# Altium schematic sheet FMC-USB-PHY-BOARD_r0.2.SchDoc: FMC-USB-PHY-BOARD-R02
size 594 x 420 mm; Author: T. Ludemann; Revision: R02; SheetNumber: 1; SheetTotal: 1; DocSize: DINA2
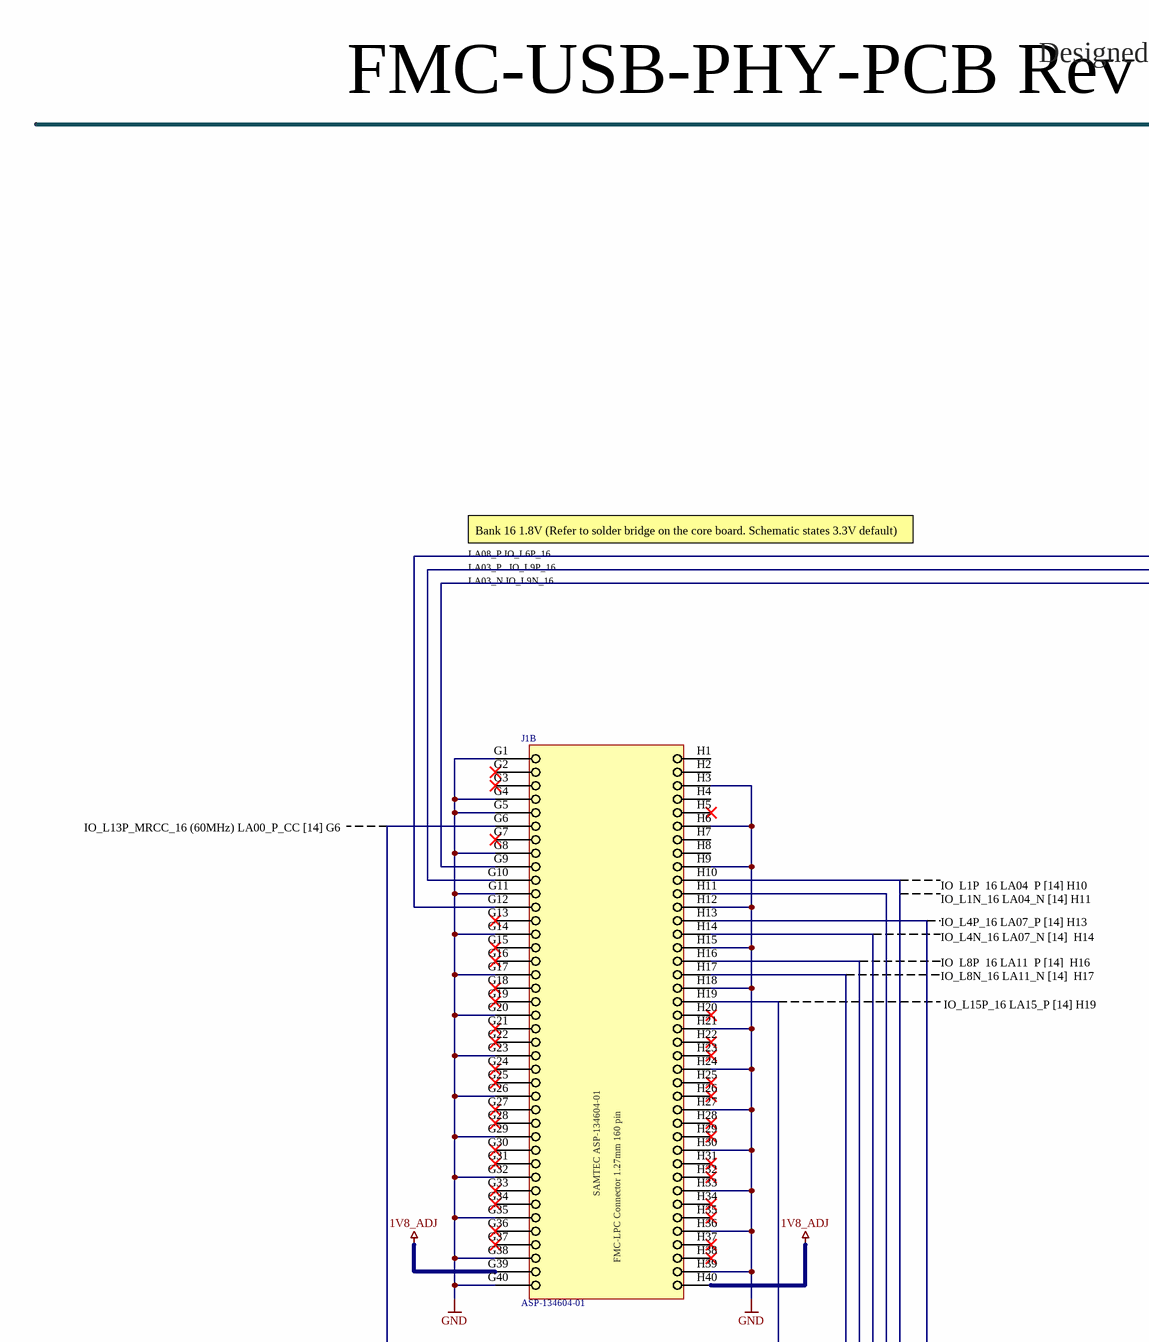
[diagram p0: FMC-USB-PHY-BOARD_r0.2.SchDoc, top left]
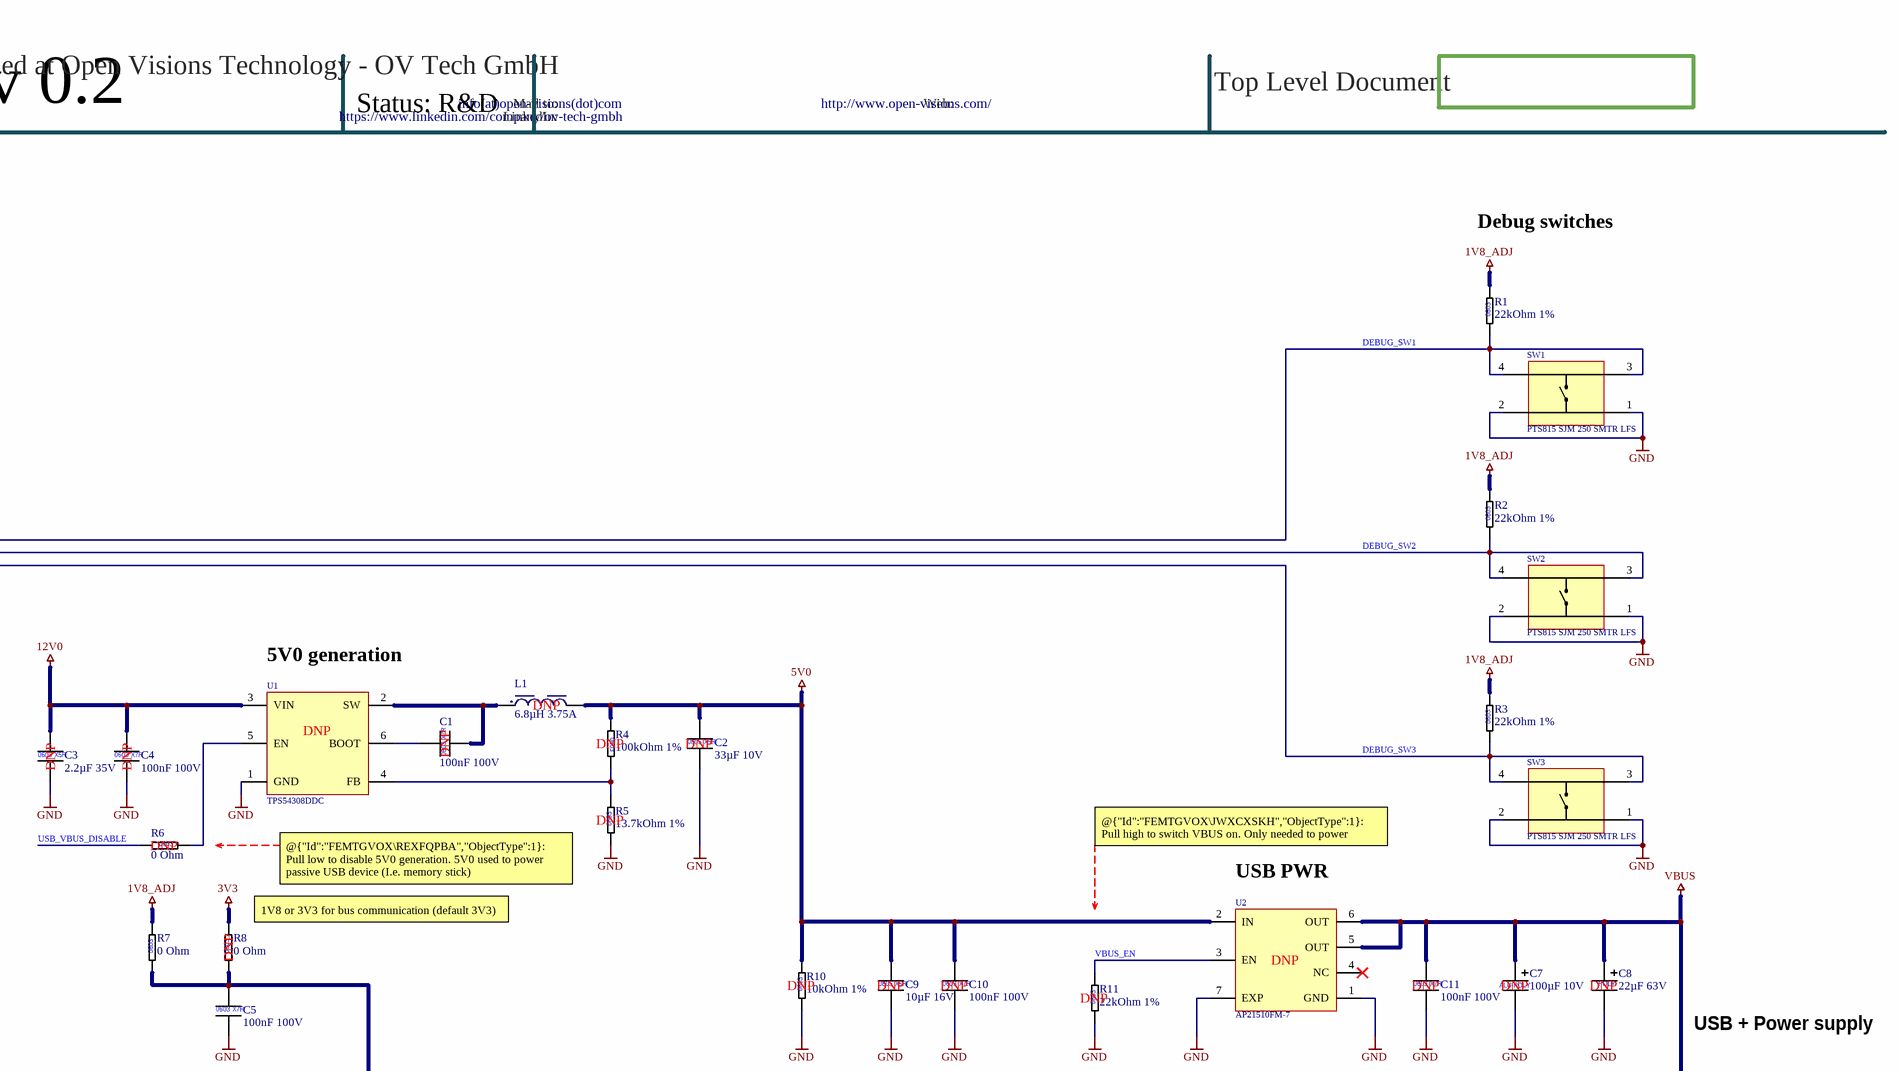
[diagram p1: FMC-USB-PHY-BOARD_r0.2.SchDoc, top right]
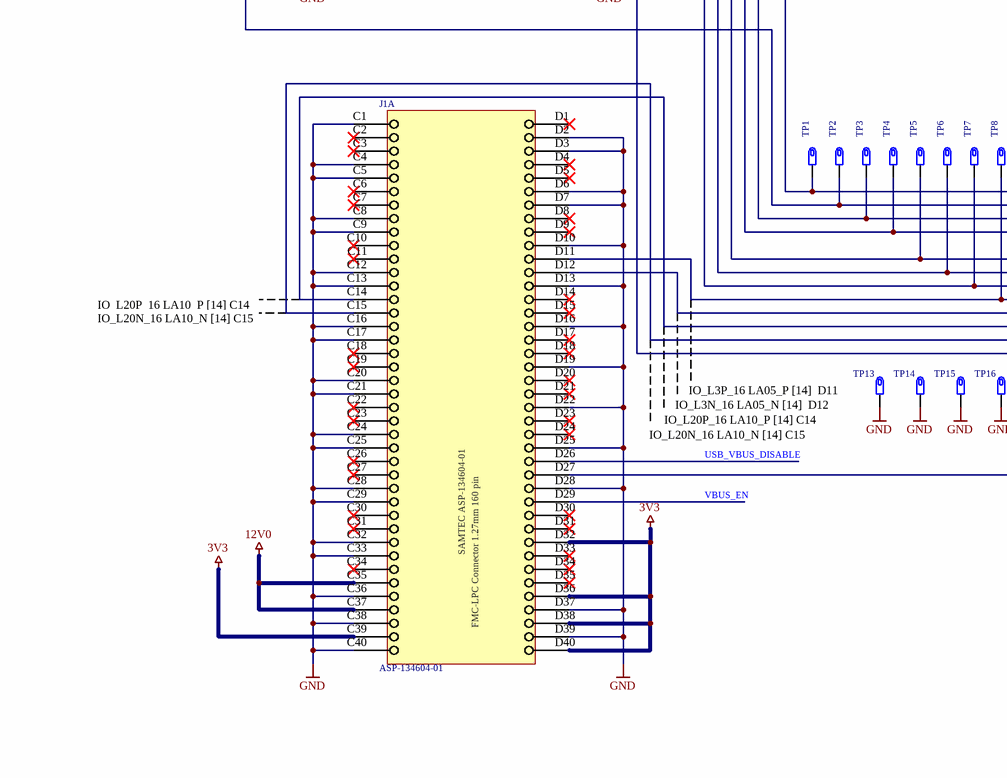
[diagram p2: FMC-USB-PHY-BOARD_r0.2.SchDoc, bottom left]
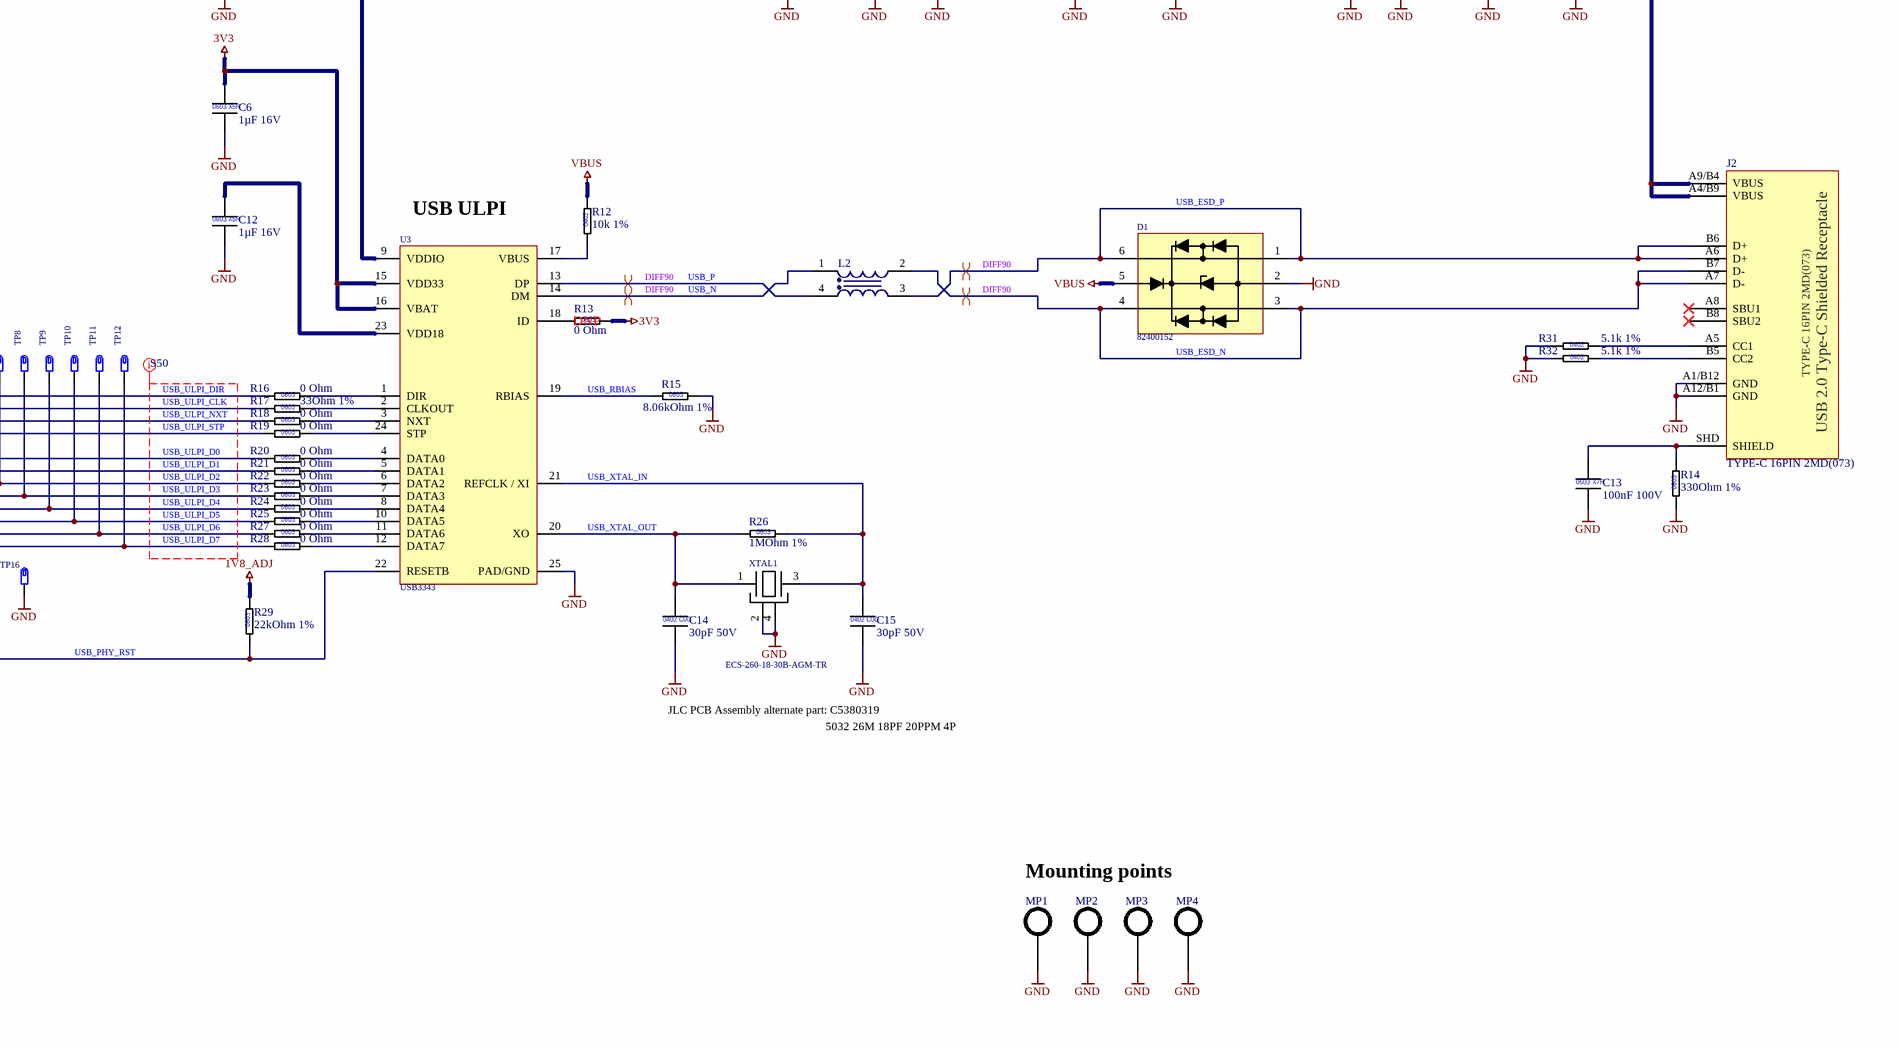
[diagram p3: FMC-USB-PHY-BOARD_r0.2.SchDoc, bottom right]

## Parts
?  (no value)  (graphical)
C1  100nF 100V  [CAPC1608X10L]  (no BOM)
C2  33µF 10V  [CAPC2012X14L]  (no BOM)
C3  2.2µF 35V  [CAPC1608X10L]  (no BOM)
C4  100nF 100V  [CAPC1608X10L]  (no BOM)
C5  100nF 100V  [CAPC1608X10L]
C6  1µF 16V  [CAPC1608X10L]
C7  100µF 10V  [CAP_Radial_5x8mm]  (no BOM)
C8  22µF 63V  [CAPAE9083X70N]  (no BOM)
C9  10µF 16V  [CAPC2012X14L]  (no BOM)
C10  100nF 100V  [CAPC1608X10L]  (no BOM)
C11  100nF 100V  [CAPC1608X10L]  (no BOM)
C12  1µF 16V  [CAPC1608X10L]
C13  100nF 100V  [CAPC1608X10L]
C14  30pF 50V  [CAPC1005X06L]
C15  30pF 50V  [CAPC1005X06L]
D1  82400152  [WE-TVS_SOT563]
J1  ASP-134604-01  [BOARD-TO-BOARD CON SAMTEC_ASP-134604-01]  (parts A,B of 2)
J2  TYPE-C 16PIN 2MD(073)  [USB Type C - TYPE-C 16PIN 2MD(073)]
L1  6.8µH 3.75A  [WE-MAPI_4030]  (no BOM)
L2  90Ohm 100mA  [WE-CNSW_0603]  (value not drawn)
MP1  MP_MOUNT_3MM_Plated  [MP_3MM_Plated]  (value not drawn)  (no BOM)
MP2  MP_MOUNT_3MM_Plated  [MP_3MM_Plated]  (value not drawn)  (no BOM)
MP3  MP_MOUNT_3MM_Plated  [MP_3MM_Plated]  (value not drawn)  (no BOM)
MP4  MP_MOUNT_3MM_Plated  [MP_3MM_Plated]  (value not drawn)  (no BOM)
R1  22kOhm 1%  [RESC1608X04L]
R2  22kOhm 1%  [RESC1608X04L]
R3  22kOhm 1%  [RESC1608X04L]
R4  100kOhm 1%  [RESC1608X04L]  (no BOM)
R5  13.7kOhm 1%  [RESC1608X04L]  (no BOM)
R6  0 Ohm  [RESC1608X04L]  (no BOM)
R7  0 Ohm  [RESC1608X04L]
R8  0 Ohm  [RESC1608X04L]  (no BOM)
R10  10kOhm 1%  [RESC1608X04L]  (no BOM)
R11  22kOhm 1%  [RESC1608X04L]  (no BOM)
R12  10k 1%  [RESC1005X04L]
R13  0 Ohm  [RESC1608X04L]  (no BOM)
R14  330Ohm 1%  [RESC1608X04L]
R15  8.06kOhm 1%  [RESC1608X04L]
R16  0 Ohm  [RESC1608X04L]
R17  33Ohm 1%  [RESC1608X04L]
R18  0 Ohm  [RESC1608X04L]
R19  0 Ohm  [RESC1608X04L]
R20  0 Ohm  [RESC1608X04L]
R21  0 Ohm  [RESC1608X04L]
R22  0 Ohm  [RESC1608X04L]
R23  0 Ohm  [RESC1608X04L]
R24  0 Ohm  [RESC1608X04L]
R25  0 Ohm  [RESC1608X04L]
R26  1MOhm 1%  [RESC1608X04L]
R27  0 Ohm  [RESC1608X04L]
R28  0 Ohm  [RESC1608X04L]
R29  22kOhm 1%  [RESC1608X04L]
R31  5.1k 1%  [RESC1005X04L]
R32  5.1k 1%  [RESC1005X04L]
SW1  PTS815 SJM 250 SMTR LFS  [SW_TACT_PTS815 SJM 250 SMTR LFS]
SW2  PTS815 SJM 250 SMTR LFS  [SW_TACT_PTS815 SJM 250 SMTR LFS]
SW3  PTS815 SJM 250 SMTR LFS  [SW_TACT_PTS815 SJM 250 SMTR LFS]
TP1  4952  [TP_Keystone_4952]  (value not drawn)
TP2  4952  [TP_Keystone_4952]  (value not drawn)
TP3  4952  [TP_Keystone_4952]  (value not drawn)
TP4  4952  [TP_Keystone_4952]  (value not drawn)
TP5  4952  [TP_Keystone_4952]  (value not drawn)
TP6  4952  [TP_Keystone_4952]  (value not drawn)
TP7  4952  [TP_Keystone_4952]  (value not drawn)
TP8  4952  [TP_Keystone_4952]  (value not drawn)
TP9  4952  [TP_Keystone_4952]  (value not drawn)
TP10  4952  [TP_Keystone_4952]  (value not drawn)
TP11  4952  [TP_Keystone_4952]  (value not drawn)
TP12  4952  [TP_Keystone_4952]  (value not drawn)
TP13  4952  [TP_Keystone_4952]  (value not drawn)
TP14  4952  [TP_Keystone_4952]  (value not drawn)
TP15  4952  [TP_Keystone_4952]  (value not drawn)
TP16  4952  [TP_Keystone_4952]  (value not drawn)
U1  TPS54308DDC  [SOT95P280X110-6N]  (no BOM)
U2  AP21510FM-7  [QFN50P201X181X60_HS-7N]  (no BOM)
U3  USB3343  [QFN50P400X400X100_HS-25M]
XTAL1  ECS-260-18-30B-AGM-TR  [XTAL_ECX-53B_5X3.2X0.85]

## Nets
1V8_ADJ: J1.G39 J1.H40 R1.2 R2.2 R3.2 R7.2 R29.2
3V3: C6.1 J1.C39 J1.D32 J1.D36 J1.D38 J1.D40 R8.2 R13.2 U3.15(VDD33) U3.16(VBAT)
5V0: C2.1 C9.1 C10.1 L1.1 R4.1 R10.2 U2.2(IN)
12V0: C3.1 C4.1 J1.C35 J1.C37 U1.3(VIN)
GND: C2.2 C3.2 C4.2 C5.2 C6.2 C7.2 C8.2 C9.2 C10.2 C11.2 C12.2 C13.2 C14.2 C15.2 D1.2(GND) J1.C1 J1.C4 J1.C5 J1.C8 J1.C9 J1.C12 J1.C13 J1.C16 J1.C17 J1.C20 J1.C21 J1.C24 J1.C25 J1.C28 J1.C29 J1.C32 J1.C33 J1.C36 J1.C38 J1.C40 J1.D2 J1.D3 J1.D6 J1.D7 J1.D10 J1.D13 J1.D16 J1.D19 J1.D22 J1.D25 J1.D28 J1.D37 J1.D39 J1.G1 J1.G4 J1.G5 J1.G8 J1.G11 J1.G14 J1.G17 J1.G20 J1.G23 J1.G26 J1.G29 J1.G32 J1.G35 J1.G38 J1.G40 J1.H3 J1.H6 J1.H9 J1.H12 J1.H15 J1.H18 J1.H21 J1.H24 J1.H27 J1.H30 J1.H33 J1.H36 J1.H39 J2.A1/B12(GND) J2.A12/B1(GND) MP1.1 MP2.1 MP3.1 MP4.1 R5.1 R10.1 R11.1 R14.1 R15.2 R31.1 R32.1 SW1.1 SW1.2 SW2.1 SW2.2 SW3.1 SW3.2 TP13.TP TP14.TP TP15.TP TP16.TP U1.1(GND) U2.1(GND) U2.7(EXP) U3.25(PAD/GND) XTAL1.2 XTAL1.4
VBUS: C7.1 C8.1 C11.1 D1.5(VDD) J2.A4/B9(VBUS) J2.A9/B4(VBUS) R12.2 U2.5(OUT) U2.6(OUT)
DEBUG_SW1: J1.G12 R1.1 SW1.3 SW1.4
DEBUG_SW2: J1.G10 R2.1 SW2.3 SW2.4
DEBUG_SW3: J1.G9 R3.1 SW3.3 SW3.4
USB_ESD_N: D1.3(I/O_2) D1.4(I/O_2) J2.A7(D-) J2.B7(D-) L2.2
USB_ESD_P: D1.1(I/O_1) D1.6(I/O_1) J2.A6(D+) J2.B6(D+) L2.3
USB_N: L2.1 U3.14(DM)
USB_P: L2.4 U3.13(DP)
USB_PHY_RST: J1.D27 R29.1 U3.22(RESETB)
USB_RBIAS: R15.1 U3.19(RBIAS)
USB_ULPI_CLK: J1.G6 R17.1 TP2.TP
USB_ULPI_D0: J1.H14 R20.1 TP5.TP
USB_ULPI_D1: J1.H16 R21.1 TP6.TP
USB_ULPI_D2: J1.H17 R22.1 TP7.TP
USB_ULPI_D3: J1.D11 R23.1 TP8.TP
USB_ULPI_D4: J1.D12 R24.1 TP9.TP
USB_ULPI_D5: J1.C14 R25.1 TP10.TP
USB_ULPI_D6: J1.C15 R27.1 TP11.TP
USB_ULPI_D7: J1.H19 R28.1 TP12.TP
USB_ULPI_DIR: J1.H13 R16.1 TP1.TP
USB_ULPI_NXT: J1.H10 R18.1 TP3.TP
USB_ULPI_STP: J1.H11 R19.1 TP4.TP
USB_VBUS_DISABLE: J1.D26 R6.1
USB_XTAL_IN: C15.1 R26.2 U3.21(REFCLK_/_XI) XTAL1.3
USB_XTAL_OUT: C14.1 R26.1 U3.20(XO) XTAL1.1
VBUS_EN: J1.D29 R11.2 U2.3(EN)
NetC1_1: C1.1 U1.6(BOOT)
NetC1_2: C1.2 L1.2 U1.2(SW)
NetC5_1: C5.1 R7.1 R8.1 U3.9(VDDIO)
NetC12_1: C12.1 U3.23(VDD18)
NetC13_1: C13.1 J2.SHD(SHIELD) R14.2
NetJ2_A5: J2.A5(CC1) R31.2
NetJ2_B5: J2.B5(CC2) R32.2
NetR4_2: R4.2 R5.2 U1.4(FB)
NetR6_2: R6.2 U1.5(EN)
NetR12_1: R12.1 U3.17(VBUS)
NetR13_1: R13.1 U3.18(ID)
NetR16_2: R16.2 U3.1(DIR)
NetR17_2: R17.2 U3.2(CLKOUT)
NetR18_2: R18.2 U3.3(NXT)
NetR19_2: R19.2 U3.24(STP)
NetR20_2: R20.2 U3.4(DATA0)
NetR21_2: R21.2 U3.5(DATA1)
NetR22_2: R22.2 U3.6(DATA2)
NetR23_2: R23.2 U3.7(DATA3)
NetR24_2: R24.2 U3.8(DATA4)
NetR25_2: R25.2 U3.10(DATA5)
NetR27_2: R27.2 U3.11(DATA6)
NetR28_2: R28.2 U3.12(DATA7)

Not connected (* = marked no-connect by the designer): J1 C2* C3* C6* C7* C10* C11* C18* C19* C22* C23* C26* C27* C30* C31* C34* D1* D4* D5* D8* D9* D14* D15* D17* D18* D20* D21* D23* D24* D30* D31* D33* D34* D35* G2* G3* G7* G13* G15* G16* G18* G19* G21* G22* G24* G25* G27* G28* G30* G31* G33* G34* G36* G37* H1 H2 H4 H5* H7 H8 H20* H22* H23* H25* H26* H28* H29* H31* H32* H34* H35* H37* H38*; J2 A8(SBU1)* B8(SBU2)*; U2 4(NC)*

## Layout directives
differential pair; differential pair class DIFF90: USB_ESD_N, USB_ESD_P, USB_N, USB_P
net class S50: USB_ULPI_CLK, USB_ULPI_D0, USB_ULPI_D1, USB_ULPI_D2, USB_ULPI_D3, USB_ULPI_D4, USB_ULPI_D5, USB_ULPI_D6, USB_ULPI_D7, USB_ULPI_DIR, USB_ULPI_NXT, USB_ULPI_STP

## Notes on the sheet
- Designed at Open Visions Technology - OV Tech GmbH
- Mail to:
- info(at)open-visions(dot)com
- Web:
- http://www.open-visions.com/
- Top Level Document
- FMC-USB-PHY-PCB Rev 0.2
- Status: R&D
- LinkedIn:
- https://www.linkedin.com/company/ov-tech-gmbh
- Debug switches
- LA08_P IO_L6P_16
- Bank 16 1.8V (Refer to solder bridge on the core board. Schematic states 3.3V default)
- LA03_P   IO_L9P_16
- LA03_N IO_L9N_16
- (near U1) 5V0 generation
- (near U1) DNP
- (near L1) DNP
- (near C3) DNP
- (near C4) DNP
- (near C1) DNP
- (near R4) DNP
- (near C2) DNP
- IO_L13P_MRCC_16 (60MHz) LA00_P_CC [14] G6
- IO_L1P_16 LA04_P [14] H10
- (near R6) DNP
- (near R5) DNP
- @{"Id":"FEMTGVOX\JWXCXSKH","ObjectType":1}: Pull high to switch VBUS on. Only needed to power passive USB devices like Memory sticks, etc.
- IO_L1N_16 LA04_N [14] H11
- IO_L4P_16 LA07_P [14] H13
- IO_L4N_16 LA07_N [14]  H14
- (near R8) 1V8 or 3V3 for bus communication (default 3V3)
- @{"Id":"FEMTGVOX\REXFQPBA","ObjectType":1}: Pull low to disable 5V0 generation. 5V0 used to power passive USB device (I.e. memory stick)
- (near U2) USB PWR
- IO_L8P_16 LA11_P [14]  H16
- IO_L8N_16 LA11_N [14]  H17
- IO_L15P_16 LA15_P [14] H19
- (near R8) DNP
- (near R10) DNP
- (near C9) DNP
- (near C10) DNP
- (near U2) DNP
- (near C11) DNP
- (near C7) DNP
- (near C8) DNP
- (near R11) DNP
- USB + Power supply
- (near U3) USB ULPI
- (near R13) DNP
- IO_L20P_16 LA10_P [14] C14
- IO_L20N_16 LA10_N [14] C15
- (near TP13) IO_L3N_16 LA05_N [14]  D12
- (near TP13) IO_L3P_16 LA05_P [14]  D11
- JLC PCB Assembly alternate part: C5380319
- 5032 26M 18PF 20PPM 4P
- Mounting points
- OV Tech GmbH - Open Visions Technology
- (in symbol 160Pin_FMC-LPC_board-to-board_Terminal_ASP-134604-01, part A) SAMTEC ASP-134604-01; FMC-LPC Connector 1.27mm 160 pin
- (in symbol 160Pin_FMC-LPC_board-to-board_Terminal_ASP-134604-01, part B) SAMTEC ASP-134604-01; FMC-LPC Connector 1.27mm 160 pin
- (in symbol CAP_0402_30pF_50V) 0402; C0G
- (in symbol CAP_0603_1µ_16V) 0603; X5R
- (in symbol CAP_0603_2.2µ_35V) 0603; X5R
- (in symbol CAP_0603_100n_100V) 0603; X7R
- (in symbol CAP_0805_10µ_16V) 0805; X5R
- (in symbol CAP_0805_33µ_10V) 0805; X5R
- (in symbol CAP_POLY_22µF_63V) POLY
- (in symbol CAP_POLY_100µ_10V) ALU-POLY
- (in symbol RES_0402_5.1k_1%) 0402
- (in symbol RES_0402_10k_1%) 0402
- (in symbol RES_0603_0R) 0603
- (in symbol RES_0603_1M_1%) 0603
- (in symbol RES_0603_8k06_1%) 0603
- (in symbol RES_0603_10k_1%) 0603
- (in symbol RES_0603_13k7_1%) 0603
- (in symbol RES_0603_22k_1%) 0603
- (in symbol RES_0603_33R_1%) 0603
- (in symbol RES_0603_100k_1%) 0603
- (in symbol RES_0603_330R_1%) 0603
- (in symbol USB 2.0 Type-C Receptacle_TYPE-C 16PIN 2MD(073)) USB 2.0 Type-C Shielded Receptacle

## Library data of the parts
? = Titleblock_01_OpenSource
C1 C4 C5 C10 C11 C13 = CAP_0603_100n_100V: Multilayer Ceramic Capacitors MLCC - SMD/SMT 0603 100VDC; Manufacturer 1: Samsung Electro-Mechanics; Manufacturer 1 Prt. Nr.: CL10B104KC8NNNC; Manufacturer 2 Prt. Nr.: HMK107B7104KA-T; Manufacturer 2: Taiyo Yuden
C2 = CAP_0805_33µ_10V: Multilayer Ceramic Capacitors MLCC - SMD/SMT 0805 10VDC; Manufacturer 1: TDK; Manufacturer 1 Prt. Nr.: C2012X5R1A336M125AC; Manufacturer 2: TDK; Manufacturer 2 Prt. Nr.: C2012X5R1A336M125AC
C3 = CAP_0603_2.2µ_35V: Multilayer Ceramic Capacitors MLCC - SMD/SMT 0603 35VDC; Manufacturer 1: TDK; Manufacturer 1 Prt. Nr.: C1608X5R1V225K080AC; Manufacturer 2 Prt. Nr.: GRT188R6YA225KE13J; Manufacturer 2: Murata Electronics
C6 C12 = CAP_0603_1µ_16V: Multilayer Ceramic Capacitors MLCC - SMD/SMT 0603 16VDC; Manufacturer 1: Samsung Electro-Mechanics; Manufacturer 1 Prt. Nr.: CL10A105KO8NNND; Manufacturer 2 Prt. Nr.: MCASE168SB7105KTNA01; Manufacturer 2: Taiyo Yuden
C7 = CAP_POLY_100µ_10V: Aluminium-Polymer capacitor  radial 10VDC; Manufacturer 1: KEMET; Manufacturer 1 Prt. Nr.: A750BK107M1AAAE024
C8 = CAP_POLY_22µF_63V: Aluminium Organic Polymer Capacitors 63V 22uF 125C 20% ESR=54mOhms; Manufacturer 1: KEMET; Manufacturer Prt. Nr. 1: A768KE226M1JLAE054
C9 = CAP_0805_10µ_16V: Multilayer Ceramic Capacitors MLCC - SMD/SMT 0603 25VDC; Manufacturer 1: Samsung Electro-Mechanics; Manufacturer 1 Prt. Nr.: CL21A106KOQNNNG; Manufacturer 2 Prt. Nr.: C0805C106K8PAC7210; Manufacturer 2: KEMET
C14 C15 = CAP_0402_30pF_50V: Multilayer Ceramic Capacitors MLCC - SMD/SMT 0402 50VDC; Manufacturer 1: KYOCERA AVX; Manufacturer 1 Prt. Nr.: KGQ05FCG1H300JH; Manufacturer 2 Prt. Nr.: C0402C300F5GACTU; Manufacturer 2: KEMET
D1 = ESD 5.5V_82400152: WE-TVS TVS Diode – High Speed / Series; Manufacturer 1: Würth Elektronik; Manufacturer 1 Prt. Nr.: 82400152
J1 = 160Pin_FMC-LPC_board-to-board_Terminal_ASP-134604-01: 160Pin FMC-LPC board-to-board connector as terminal ASP-134604-01; Manufacturer 1: Samtec; Manufacturer 1 Prt. Nr.: ASP-134604-01
J2 = USB 2.0 Type-C Receptacle_TYPE-C 16PIN 2MD(073): USB 2.0 C Receptacle Horizontal 16P; Manufacturer 1: SHOU HAN; Manufacturer 1 Prt. Nr.: TYPE-C 16PIN 2MD(073)
L1 = IND_WE-MAPI_6.8µH_3.75A: WE-MAPI SMT Power Inductor shielded; Manufacturer 1 Prt. Nr.: Würth Elektronik; Manufacturer 1: 74438357068
L2 = Common Mode Choke_744230900: WE-CNSW SMT Common Mode / Line Filter; Manufacturer 1: Würth Elektronik; Manufacturer 1 Prt. Nr.: 744230900
MP1-MP4 = MP_MOUNT_3MM_Plated: Mounting hole with 1 mm radius
R1-R3 R11 R29 = RES_0603_22k_1%: Thick Film Resistors - SMD 22kOHM 1%; Manufacturer 1: Yageo; Manufacturer 1 Prt. Nr.: AC0603FR-0722KL; Manufacturer 2 Prt. Nr.: CRCW060322K0FKEA; Manufacturer 2: Vishay / Dale
R4 = RES_0603_100k_1%: Thick Film Resistors - SMD 100kOHM 1%; Manufacturer 1: Yageo; Manufacturer 1 Prt. Nr.: RC0603FR-10100KL; Manufacturer 2 Prt. Nr.: CRGH0603J100K; Manufacturer 2: TE Connectivity / Holsworthy
R5 = RES_0603_13k7_1%: Thick Film Resistors - SMD 13.7kOHM 1%; Manufacturer 1: Vishay / Dale; Manufacturer 1 Prt. Nr.: CRCW060313K7FKEA; Manufacturer 2 Prt. Nr.: CR0603-FX-1372ELF; Manufacturer 2: Bourns
R6-R8 R13 R16 R18-R25 R27 R28 = RES_0603_0R: Thick Film Resistors - SMD 0 Ohm; Manufacturer 1: Panasonic; Manufacturer 1 Prt. Nr.: ERJ-3GEY0R00V; Manufacturer 2 Prt. Nr.: CRCW06030000Z0EAHP; Manufacturer 2: Vishay / Dale
R10 = RES_0603_10k_1%: Thick Film Resistors - SMD 10kOHM 1%; Manufacturer 1: Yageo; Manufacturer 1 Prt. Nr.: AF0603FR-0710KL; Manufacturer 2 Prt. Nr.: CRCW060310K0FKEB; Manufacturer 2: Vishay / Dale
R12 = RES_0402_10k_1%: Thick Film Resistors - SMD 10k 1%; Manufacturer 1: Vishay / Dale; Manufacturer 1 Prt. Nr.: CRCW040210K0FKEDC; Manufacturer 2 Prt. Nr.: RT0402FRE0710KL; Manufacturer 2: YAGEO
R14 = RES_0603_330R_1%: Thick Film Resistors - SMD 330OHM 1%; Manufacturer 1: Yageo; Manufacturer 1 Prt. Nr.: RC0603FR-10330RL; Manufacturer 2 Prt. Nr.: WCR0603-330RFI; Manufacturer 2: Welwyn Components / TT Electronics
R15 = RES_0603_8k06_1%: Thick Film Resistors - SMD 8.06kOHM 1%; Manufacturer 1: Bourns; Manufacturer 1 Prt. Nr.: CR0603-FX-8061ELF; Manufacturer 2 Prt. Nr.: CRCW06038K06FKEA; Manufacturer 2: Vishay / Dale
R17 = RES_0603_33R_1%: Thick Film Resistors - SMD 33OHM 1%; Manufacturer 1: YAGEO; Manufacturer 1 Prt. Nr.: RC0603FR-7W33RL; Manufacturer 2 Prt. Nr.: CR0603AFX-33R0EAS; Manufacturer 2: Bourns
R26 = RES_0603_1M_1%: Thick Film Resistors - SMD 1MOHM 1%; Manufacturer 1: Bourns; Manufacturer 1 Prt. Nr.: CR0603-FX-1004ELF; Manufacturer 2 Prt. Nr.: RCC06031M00FKEA; Manufacturer 2: Vishay / Dale
R31 R32 = RES_0402_5.1k_1%: Thick Film Resistors - SMD 5.1k 1%; Manufacturer 1: Vishay / Dale; Manufacturer 1 Prt. Nr.: CRCW04025K10FKEDC; Manufacturer 2 Prt. Nr.: RC0402FR-075K1L; Manufacturer 2: Yageo
SW1-SW3 = SW_TACTILE_PTS815 SJM 250 SMTR LFS: SMD Switch Tactile SMD 4,20mm x 3,20mm; Manufacturer 1: C&K; Manufacturer 1 Prt. Nr.: PTS815 SJM 250 SMTR LFS
TP1-TP16 = Testpoint_Keystone_4952: Loop Type THM Test Point P/N 4952; Manufacturer 1: Keystone; Manufacturer 1 Prt. Nr.: 4952
U1 = Buck 3A 28V_TPS54308DDC: 4.5-V to 28-V Input, 3-A Output, Synchronous 350-kHz FCCM Step-Down Converter in SOT23 Package; Manufacturer 1: Texas Instruments; Manufacturer 1 Prt. Nr.: TPS54308DDC
U2 = Power Switch with Current limit 400mA_AP21510FM-7: Power switch with 400mA Current limit up to 5.5V Input; Manufacturer 1: Diodes Incorporated; Manufacturer 1 Prt. Nr.: AP21510FM-7
U3 = USB ULPI Hi-Speed transceiver_USB3343: 26Mhz USB 2.0 ULPI PHY IC with Variable I/O voltage; Manufacturer 1: Microchip; Manufacturer 1 Prt. Nr.: USB3343
XTAL1 = Crystal_ECX-ECS-260-18-30B-AGM_40MHz: SMD Crystal 26 MHz 18pF; Manufacturer 1: ECS; Manufacturer 1 Prt. Nr.: ECS-260-18-30B-AGM-TR